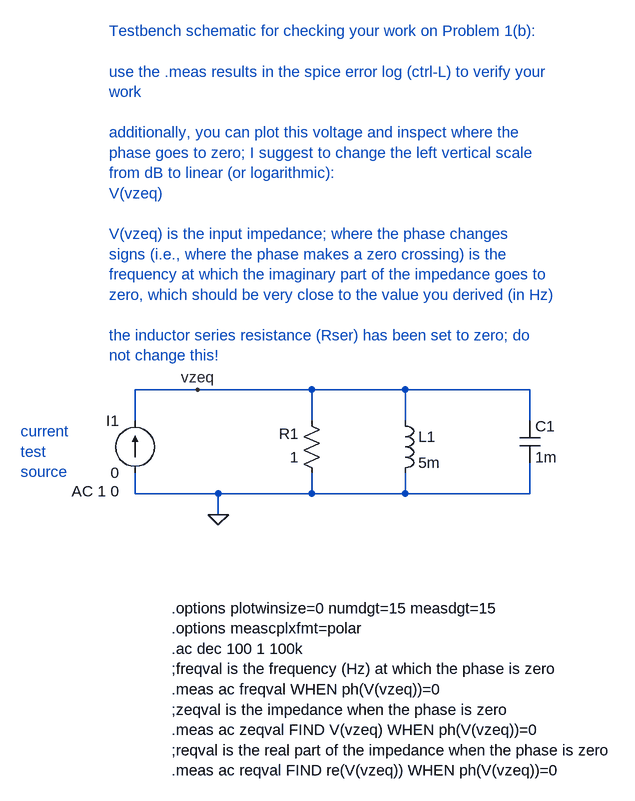
[diagram p0: schematic hw7_prob1b.asc]
hw7_prob1b.asc, the LTspice schematic file:
Version 4
SHEET 1 1004 680
WIRE -544 -16 -640 -16
WIRE -368 -16 -544 -16
WIRE -224 -16 -368 -16
WIRE -32 -16 -224 -16
WIRE -640 32 -640 -16
WIRE -368 32 -368 -16
WIRE -224 32 -224 -16
WIRE -32 32 -32 -16
WIRE -640 144 -640 112
WIRE -512 144 -640 144
WIRE -368 144 -368 112
WIRE -368 144 -512 144
WIRE -224 144 -224 112
WIRE -224 144 -368 144
WIRE -32 144 -32 96
WIRE -32 144 -224 144
WIRE -512 176 -512 144
FLAG -512 176 0
FLAG -544 -16 vzeq
SYMBOL res -352 128 R180
WINDOW 0 36 76 Left 2
WINDOW 3 36 40 Left 2
SYMATTR InstName R1
SYMATTR Value 1
SYMBOL ind -240 16 R0
SYMATTR InstName L1
SYMATTR Value 5m
SYMATTR SpiceLine Rser=0
SYMBOL cap -48 32 R0
SYMATTR InstName C1
SYMATTR Value 1m
SYMBOL current -640 112 R180
WINDOW 0 24 80 Left 2
WINDOW 3 24 0 Left 2
WINDOW 123 24 -28 Left 2
SYMATTR InstName I1
SYMATTR Value 0
SYMATTR Value2 AC 1 0
TEXT -680 -568 Left 2 ;Testbench schematic for checking your work on Problem 1(b):\n \nuse the .meas results in the spice error log (ctrl-L) to verify your \nwork\n \nadditionally, you can plot this voltage and inspect where the \nphase goes to zero; I suggest to change the left vertical scale\nfrom dB to linear (or logarithmic):\nV(vzeq)\n \nV(vzeq) is the input impedance; where the phase changes \nsigns (i.e., where the phase makes a zero crossing) is the \nfrequency at which the imaginary part of the impedance goes to \nzero, which should be very close to the value you derived (in Hz)\n \nthe inductor series resistance (Rser) has been set to zero; do\nnot change this!
TEXT -816 48 Left 2 ;current\ntest\nsource
TEXT -584 320 Left 2 !.options plotwinsize=0 numdgt=15 measdgt=15\n.options meascplxfmt=polar\n.ac dec 100 1 100k\n;freqval is the frequency (Hz) at which the phase is zero\n.meas ac freqval WHEN ph(V(vzeq))=0\n;zeqval is the impedance when the phase is zero\n.meas ac zeqval FIND V(vzeq) WHEN ph(V(vzeq))=0\n;reqval is the real part of the impedance when the phase is zero\n.meas ac reqval FIND re(V(vzeq)) WHEN ph(V(vzeq))=0

The netlist it stands for:
* hw7_prob1b.asc
R1 0 vzeq 1
L1 vzeq 0 5m Rser=0
C1 vzeq 0 1m
I1 0 vzeq 0 AC 1 0
* Testbench schematic for checking your work on Problem 1(b):
* use the .meas results in the spice error log (ctrl-L) to verify your
* work
* additionally, you can plot this voltage and inspect where the
* phase goes to zero; I suggest to change the left vertical scale
* from dB to linear (or logarithmic):
* V(vzeq)
* V(vzeq) is the input impedance; where the phase changes
* signs (i.e., where the phase makes a zero crossing) is the
* frequency at which the imaginary part of the impedance goes to
* zero, which should be very close to the value you derived (in Hz)
* the inductor series resistance (Rser) has been set to zero; do
* not change this!
* current
* test
* source
.options plotwinsize=0 numdgt=15 measdgt=15
.options meascplxfmt=polar
.ac dec 100 1 100k
;freqval is the frequency (Hz) at which the phase is zero
.meas ac freqval WHEN ph(V(vzeq))=0
;zeqval is the impedance when the phase is zero
.meas ac zeqval FIND V(vzeq) WHEN ph(V(vzeq))=0
;reqval is the real part of the impedance when the phase is zero
.meas ac reqval FIND re(V(vzeq)) WHEN ph(V(vzeq))=0
.backanno
.end

* Results of the author's LTspice run, read from the files saved beside the schematic
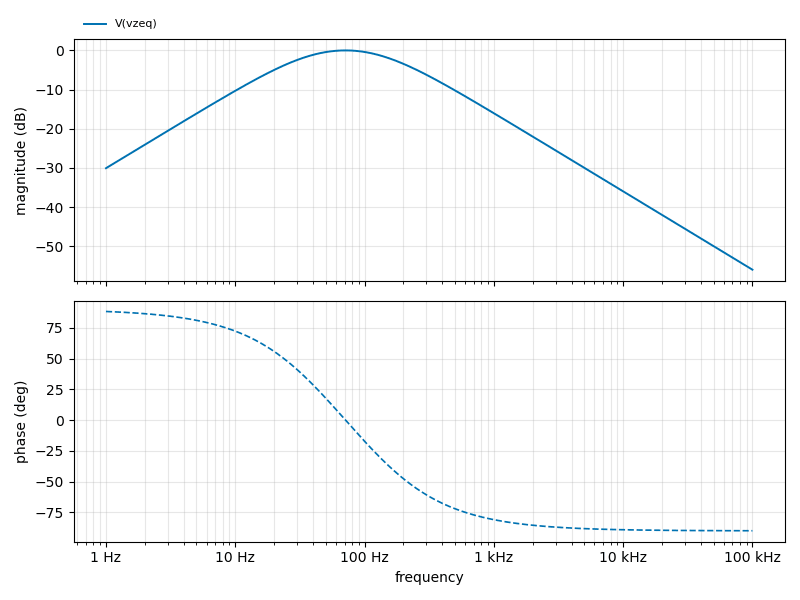
[diagram p1: AC Analysis of hw7_prob1b.asc, plotted from the saved traces]
* AC Analysis, 1 run:
*   V(vzeq): -30.06 dB at 1 Hz, -55.96 dB at 100 kHz, peak -0.00 dB at 70.79 Hz, 3 dB below the peak at 27.19 Hz and 186.3 Hz
* From the log:
*   freqval: ph(v(vzeq))=0 AT 71.1796537316
*   zeqval: v(vzeq)=(0.999924090883,3.18281169982e-05°) at 71.1796537316
*   reqval: re(v(vzeq))=(0.999924090883,0°) at 71.1796537316